# EAGLE design podlewacz_v4 (EAGLE 7.5.0)
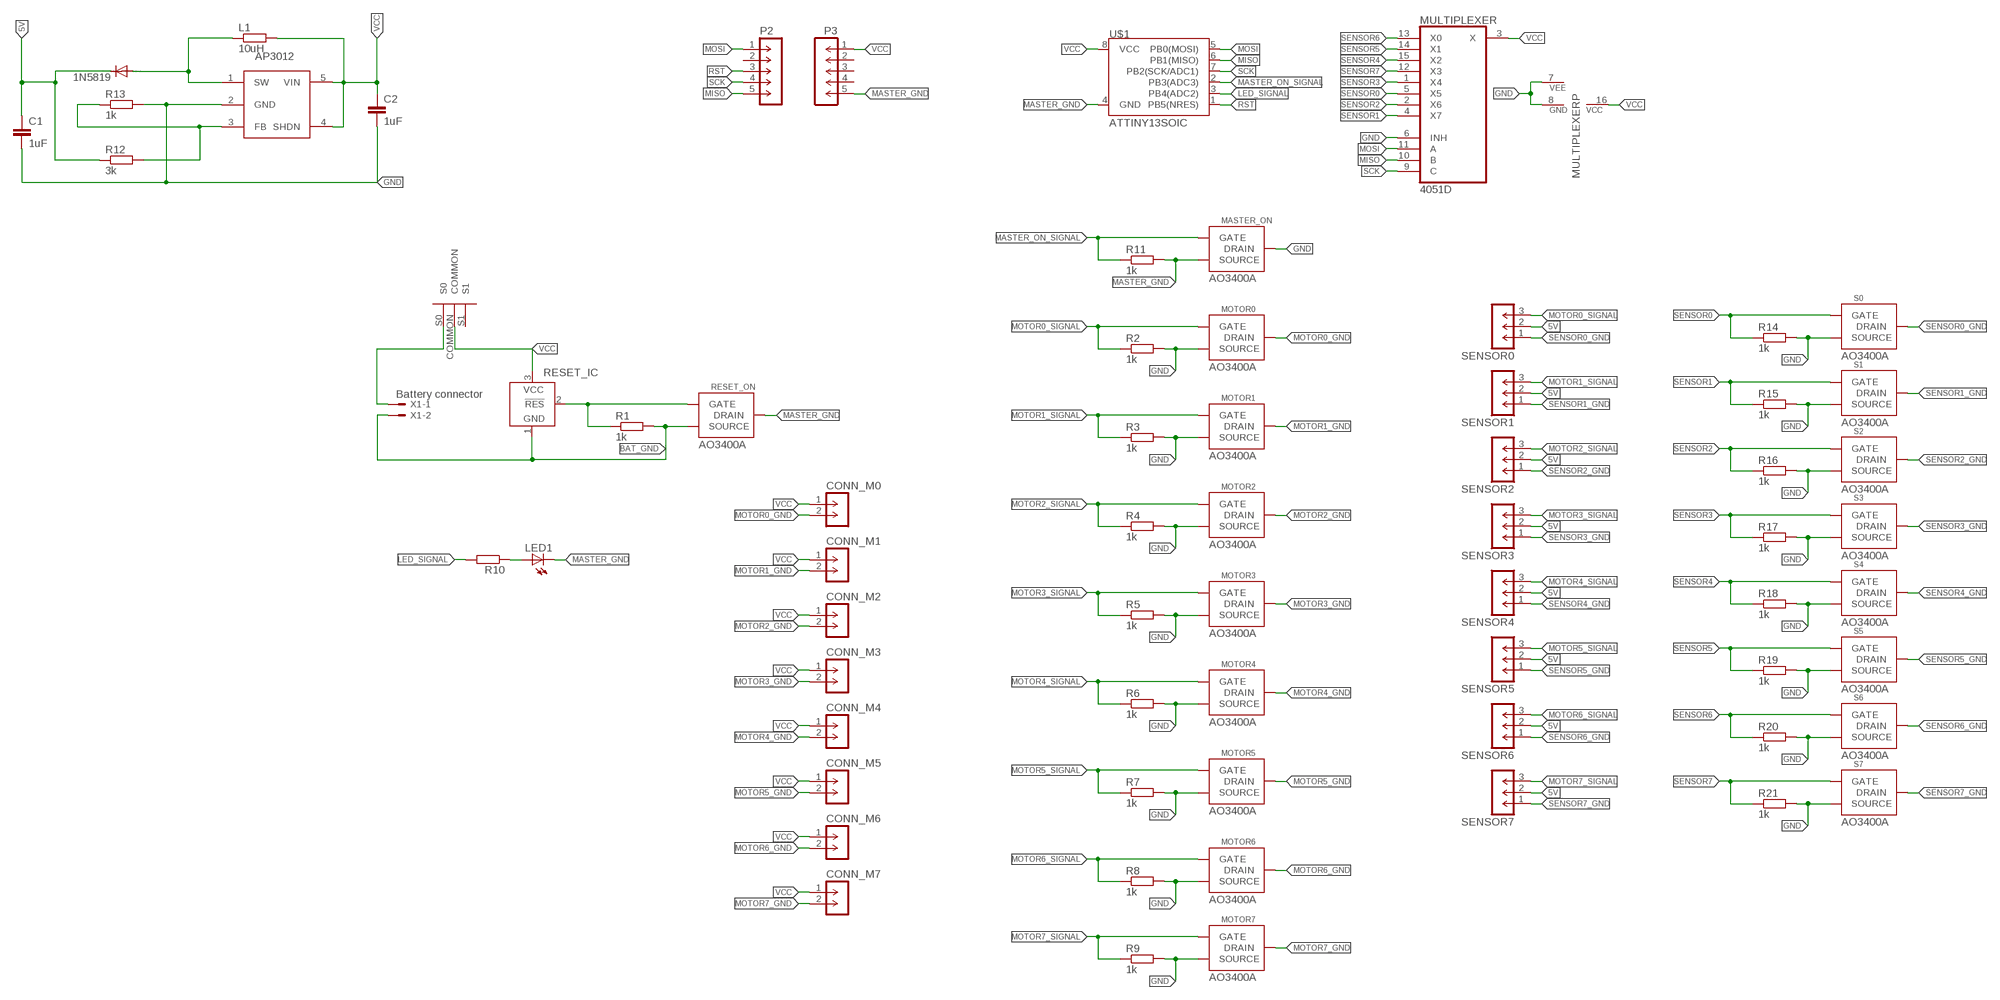
[diagram p0: schematic, sheet 1]

## Parts
1N5819  DIODE-DO214AC  [DO214AC]
AP3012  AP3012  [SOT-23-5]
C1  1uF  C-EUC1206  [C1206]
C2  1uF  C-EUC1206  [C1206]
CONN_M0  M-1X02-SIP-100-32Y  [SIP-100-02-32Y]
CONN_M1  M-1X02-SIP-100-32Y  [SIP-100-02-32Y]
CONN_M2  M-1X02-SIP-100-32Y  [SIP-100-02-32Y]
CONN_M3  M-1X02-SIP-100-32Y  [SIP-100-02-32Y]
CONN_M4  M-1X02-SIP-100-32Y  [SIP-100-02-32Y]
CONN_M5  M-1X02-SIP-100-32Y  [SIP-100-02-32Y]
CONN_M6  M-1X02-SIP-100-32Y  [SIP-100-02-32Y]
CONN_M7  M-1X02-SIP-100-32Y  [SIP-100-02-32Y]
L1  10uH  R-EU_R0805  [R0805]
LED1  LEDCHIP-LED0805  [CHIP-LED0805]
MASTER_ON  AO3400A  [SOT-23]
MOTOR0  AO3400A  [SOT-23]
MOTOR1  AO3400A  [SOT-23]
MOTOR2  AO3400A  [SOT-23]
MOTOR3  AO3400A  [SOT-23]
MOTOR4  AO3400A  [SOT-23]
MOTOR5  AO3400A  [SOT-23]
MOTOR6  AO3400A  [SOT-23]
MOTOR7  AO3400A  [SOT-23]
MULTIPLEXER  4051D  [SO16]
P2  M-1X05-SIP-100-32  [SIP-100-05-32]
P3  M-1X05-SIP-100-32  [SIP-100-05-32]
R1  1k  R-EU_M1206  [M1206]
R2  1k  R-EU_M1206  [M1206]
R3  1k  R-EU_M1206  [M1206]
R4  1k  R-EU_M1206  [M1206]
R5  1k  R-EU_M1206  [M1206]
R6  1k  R-EU_M1206  [M1206]
R7  1k  R-EU_M1206  [M1206]
R8  1k  R-EU_M1206  [M1206]
R9  1k  R-EU_M1206  [M1206]
R10  R-EU_M0805  [M0805]
R11  1k  R-EU_M1206  [M1206]
R12  3k  R-EU_M1206  [M1206]
R13  1k  R-EU_M1206  [M1206]
R14  1k  R-EU_M1206  [M1206]
R15  1k  R-EU_M1206  [M1206]
R16  1k  R-EU_M1206  [M1206]
R17  1k  R-EU_M1206  [M1206]
R18  1k  R-EU_M1206  [M1206]
R19  1k  R-EU_M1206  [M1206]
R20  1k  R-EU_M1206  [M1206]
R21  1k  R-EU_M1206  [M1206]
RESET_IC  TCM809  [SOT23B-3]
RESET_ON  AO3400A  [SOT-23]
S0  AO3400A  [SOT-23]
S1  AO3400A  [SOT-23]
S2  AO3400A  [SOT-23]
S3  AO3400A  [SOT-23]
S4  AO3400A  [SOT-23]
S5  AO3400A  [SOT-23]
S6  AO3400A  [SOT-23]
S7  AO3400A  [SOT-23]
SENSOR0  M-1X03-SIP-100-32Y  [SIP-100-03-32Y]
SENSOR1  M-1X03-SIP-100-32Y  [SIP-100-03-32Y]
SENSOR2  M-1X03-SIP-100-32Y  [SIP-100-03-32Y]
SENSOR3  M-1X03-SIP-100-32Y  [SIP-100-03-32Y]
SENSOR4  M-1X03-SIP-100-32Y  [SIP-100-03-32Y]
SENSOR5  M-1X03-SIP-100-32Y  [SIP-100-03-32Y]
SENSOR6  M-1X03-SIP-100-32Y  [SIP-100-03-32Y]
SENSOR7  M-1X03-SIP-100-32Y  [SIP-100-03-32Y]
U$1  ATTINY13SOIC  [SO08]
U$2  SPDT_SLIDE_SWITCH_2_PITCH  [SPDT_SLIDE_SWITCH_2_PITCH]
X1  Battery connector  22-23-2021  [22-23-2021]

## Nets
5V: 1N5819.C C1.1 R12.1 SENSOR0.2 SENSOR1.2 SENSOR2.2 SENSOR3.2 SENSOR4.2 SENSOR5.2 SENSOR6.2 SENSOR7.2
BAT_GND: R1.2 RESET_IC.1(GND) RESET_ON.2(SOURCE) X1.2
GND: AP3012.2(GND) C1.2 C2.2 MASTER_ON.3(DRAIN) MOTOR0.2(SOURCE) MOTOR1.2(SOURCE) MOTOR2.2(SOURCE) MOTOR3.2(SOURCE) MOTOR4.2(SOURCE) MOTOR5.2(SOURCE) MOTOR6.2(SOURCE) MOTOR7.2(SOURCE) MULTIPLEXER.6(INH) MULTIPLEXER.7(VEE) MULTIPLEXER.8(GND) R2.2 R3.2 R4.2 R5.2 R6.2 R7.2 R8.2 R9.2 R13.2 R14.2 R15.2 R16.2 R17.2 R18.2 R19.2 R20.2 R21.2 S0.2(SOURCE) S1.2(SOURCE) S2.2(SOURCE) S3.2(SOURCE) S4.2(SOURCE) S5.2(SOURCE) S6.2(SOURCE) S7.2(SOURCE)
LED_SIGNAL: R10.2 U$1.3(PB4(ADC2))
MASTER_GND: LED1.C MASTER_ON.2(SOURCE) P3.5 R11.2 RESET_ON.3(DRAIN) U$1.4(GND)
MASTER_ON: R1.1 RESET_IC.2(!RES) RESET_ON.1(GATE)
MASTER_ON_SIGNAL: MASTER_ON.1(GATE) R11.1 U$1.2(PB3(ADC3))
MISO: MULTIPLEXER.10(B) P2.5 U$1.6(PB1(MISO))
MOSI: MULTIPLEXER.11(A) P2.1 U$1.5(PB0(MOSI))
MOTOR0_GND: CONN_M0.2 MOTOR0.3(DRAIN)
MOTOR0_SIGNAL: MOTOR0.1(GATE) R2.1 SENSOR0.3
MOTOR1_GND: CONN_M1.2 MOTOR1.3(DRAIN)
MOTOR1_SIGNAL: MOTOR1.1(GATE) R3.1 SENSOR1.3
MOTOR2_GND: CONN_M2.2 MOTOR2.3(DRAIN)
MOTOR2_SIGNAL: MOTOR2.1(GATE) R4.1 SENSOR2.3
MOTOR3_GND: CONN_M3.2 MOTOR3.3(DRAIN)
MOTOR3_SIGNAL: MOTOR3.1(GATE) R5.1 SENSOR3.3
MOTOR4_GND: CONN_M4.2 MOTOR4.3(DRAIN)
MOTOR4_SIGNAL: MOTOR4.1(GATE) R6.1 SENSOR4.3
MOTOR5_GND: CONN_M5.2 MOTOR5.3(DRAIN)
MOTOR5_SIGNAL: MOTOR5.1(GATE) R7.1 SENSOR5.3
MOTOR6_GND: CONN_M6.2 MOTOR6.3(DRAIN)
MOTOR6_SIGNAL: MOTOR6.1(GATE) R8.1 SENSOR6.3
MOTOR7_GND: CONN_M7.2 MOTOR7.3(DRAIN)
MOTOR7_SIGNAL: MOTOR7.1(GATE) R9.1 SENSOR7.3
N$1: U$2.S0 X1.1
N$2: LED1.A R10.1
N$6: 1N5819.A AP3012.1(SW) L1.1
N$10: AP3012.3(FB) R12.2 R13.1
RST: P2.3 U$1.1(PB5(NRES))
SCK: MULTIPLEXER.9(C) P2.4 U$1.7(PB2(SCK/ADC1))
SENSOR0: MULTIPLEXER.5(X5) R14.1 S0.1(GATE)
SENSOR0_GND: S0.3(DRAIN) SENSOR0.1
SENSOR1: MULTIPLEXER.4(X7) R15.1 S1.1(GATE)
SENSOR1_GND: S1.3(DRAIN) SENSOR1.1
SENSOR2: MULTIPLEXER.2(X6) R16.1 S2.1(GATE)
SENSOR2_GND: S2.3(DRAIN) SENSOR2.1
SENSOR3: MULTIPLEXER.1(X4) R17.1 S3.1(GATE)
SENSOR3_GND: S3.3(DRAIN) SENSOR3.1
SENSOR4: MULTIPLEXER.15(X2) R18.1 S4.1(GATE)
SENSOR4_GND: S4.3(DRAIN) SENSOR4.1
SENSOR5: MULTIPLEXER.14(X1) R19.1 S5.1(GATE)
SENSOR5_GND: S5.3(DRAIN) SENSOR5.1
SENSOR6: MULTIPLEXER.13(X0) R20.1 S6.1(GATE)
SENSOR6_GND: S6.3(DRAIN) SENSOR6.1
SENSOR7: MULTIPLEXER.12(X3) R21.1 S7.1(GATE)
SENSOR7_GND: S7.3(DRAIN) SENSOR7.1
VCC: AP3012.4(SHDN) AP3012.5(VIN) C2.1 CONN_M0.1 CONN_M1.1 CONN_M2.1 CONN_M3.1 CONN_M4.1 CONN_M5.1 CONN_M6.1 CONN_M7.1 L1.2 MULTIPLEXER.3(X) MULTIPLEXER.16(VCC) P3.1 RESET_IC.3(VCC) U$1.8(VCC) U$2.COMMON
Unconnected: P2.2 P3.2 P3.3 P3.4 U$2.S1

## Library data of the parts
1N5819 = diode:DIODE-: DIODE
AP3012 = smd-footprints:AP3012
C1 C2 = resistor:C-EU: CAPACITOR, European symbol
CONN_M0 CONN_M1-CONN_M7 = con-headers-jp:M-1X02-: MALE HEADER
L1 R1-R21 = resistor:R-EU_: RESISTOR, European symbol
LED1 = led:LED: LED OSRAM: - CHIPLED LG R971, LG N971, LY N971, LG Q971, LY Q971, LO R971, LY R971 LH N974, LH R974 LS Q976, LO Q976, LY Q976 LO Q996 - Hyper CHIPLED LW Q18S LB Q993, LB Q99A, LB R99A - SideLED LS A670, LO A670, LY A670, LG A670, LP A670 LB A673, LV A673, LT A673, LW A673 LH A674 LY A675 LS A676, LA A676, LO A676, LY A676, LW A676 LS A679, LY A679, LG A679 - Hyper Micro SIDELED® LS Y876, LA Y876, LO Y876, LY Y876 LT Y87S - SmartLED LW L88C, LW L88S LB L89C, LB L89S, LG L890 LS L89K, LO L89K, LY L89K LS L896, LA L896, LO L896, LY L896 - TOPLED LS T670, LO T670, LY T670, LG T670, LP T670 LSG T670, LSP T670, LSY T670, LOP T670, LYG T670 LG T671, LOG T671, LSG T671 LB T673, LV T673, LT T673, LW T673 LH T674 LS T676, LA T676, LO T676, LY T676, LB T676, LH T676, LSB T676, LW T676 LB T67C, LV T67C, LT T67C, LS T67K, LO T67K, LY T67K, LW E67C LS E67B, LA E67B, LO E67B, LY E67B, LB E67C, LV E67C, LT E67C LW T67C LS T679, LY T679, LG T679 LS T770, LO T770, LY T770, LG T770, LP T770 LB T773, LV T773, LT T773, LW T773 LH T774 LS E675, LA E675, LY E675, LS T675 LS T776, LA T776, LO T776, LY T776, LB T776 LHGB T686 LT T68C, LB T68C - Hyper Mini TOPLED® LB M676 - Mini TOPLED Santana® LG M470 LS M47K, LO M47K, LY M47K Source: http://www.osram.convergy.de LUXEON: - LUMILED® LXK2-PW12-R00, LXK2-PW12-S00, LXK2-PW14-U00, LXK2-PW14-V00 LXK2-PM12-R00, LXK2-PM12-S00, LXK2-PM14-U00 LXK2-PE12-Q00, LXK2-PE12-R00, LXK2-PE12-S00, LXK2-PE14-T00, LXK2-PE14-U00 LXK2-PB12-K00, LXK2-PB12-L00, LXK2-PB12-M00, LXK2-PB14-N00, LXK2-PB14-P00, LXK2-PB14-Q00 LXK2-PR12-L00, LXK2-PR12-M00, LXK2-PR14-Q00, LXK2-PR14-R00 LXK2-PD12-Q00, LXK2-PD12-R00, LXK2-PD12-S00 LXK2-PH12-R00, LXK2-PH12-S00 LXK2-PL12-P00, LXK2-PL12-Q00, LXK2-PL12-R00 Source: www.luxeon.com KINGBRIGHT: KA-3528ASYC Source: www.kingbright.com
MASTER_ON MOTOR0 MOTOR1-MOTOR7 RESET_ON S0 S1-S7 = smd-footprints:AO3400A
MULTIPLEXER = 40xx:4051: 8-channel ANALOG MULTIPLEXER
P2 P3 = con-headers-jp:M-1X05-: MALE HEADER
RESET_IC = telcom:TCM809: POWER SUPPLY MONITOR replacement for Maxim MAX809 and MAX810; MF: MICROCHIP; MPN: TCM809MENB713; OC_FARNELL: 9762744; OC_NEWARK: 96K3998
SENSOR0 SENSOR1-SENSOR7 = con-headers-jp:M-1X03-: MALE HEADER
U$1 = SparkFun-DigitalIC:ATTINY13: Atmel 8-pin 1kB flash uC
U$2 = sh4dov lib:SPDT_SLIDE_SWITCH_2_PITCH
X1 = con-molex:22-23-2021: .100" (2.54mm) Center Header - 2 Pin; MF: MOLEX; MPN: 22-23-2021; OC_FARNELL: 1462926; OC_NEWARK: 25C3832

## Board
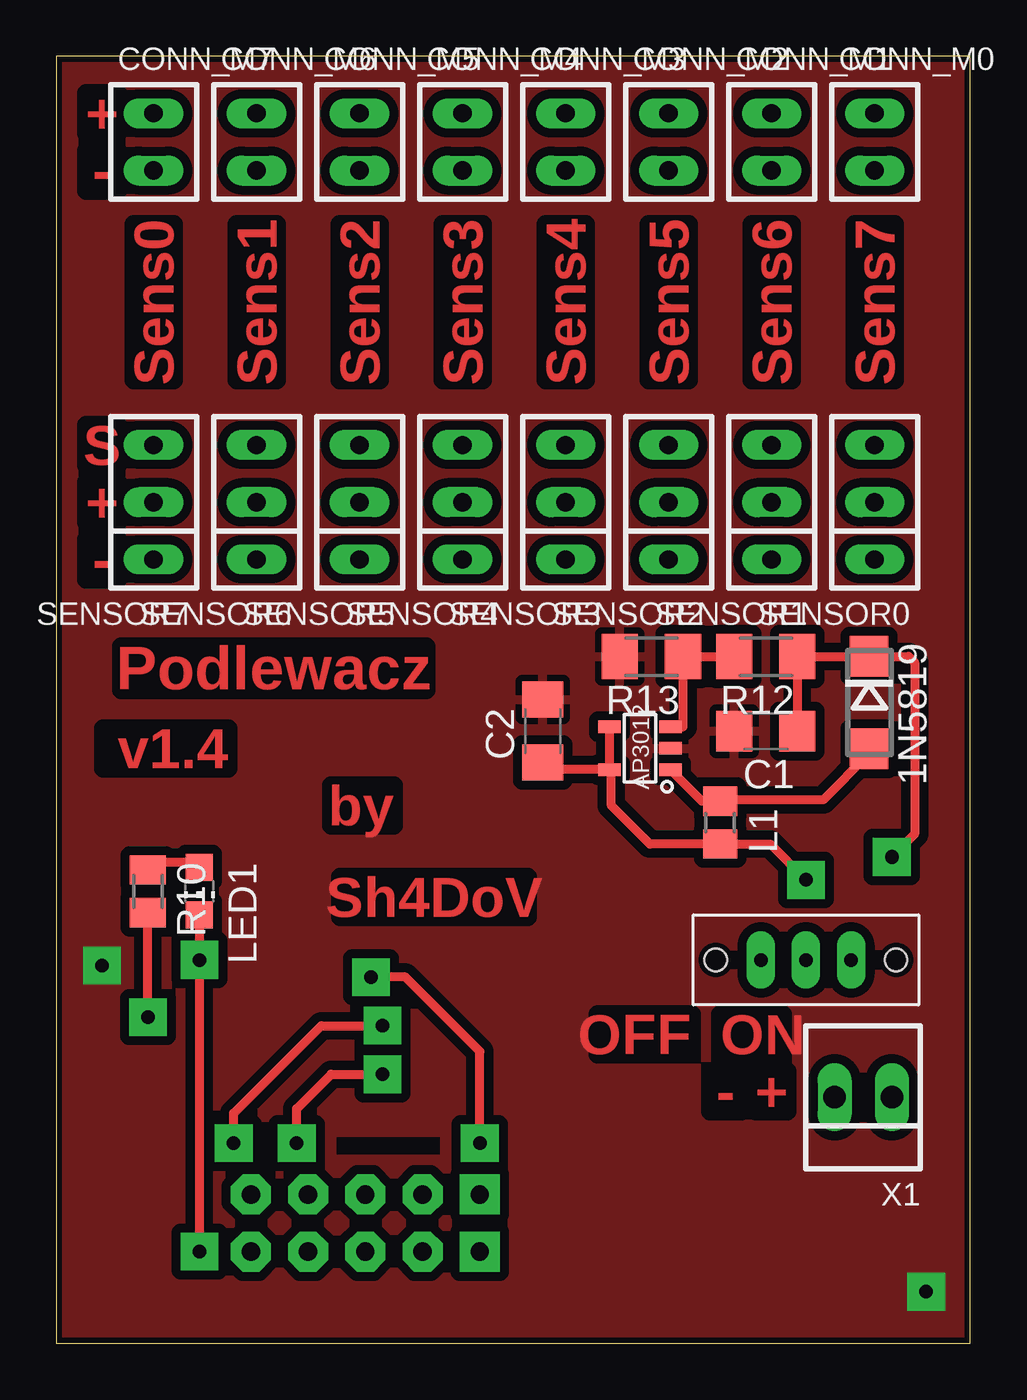
[diagram p1: board, top side]
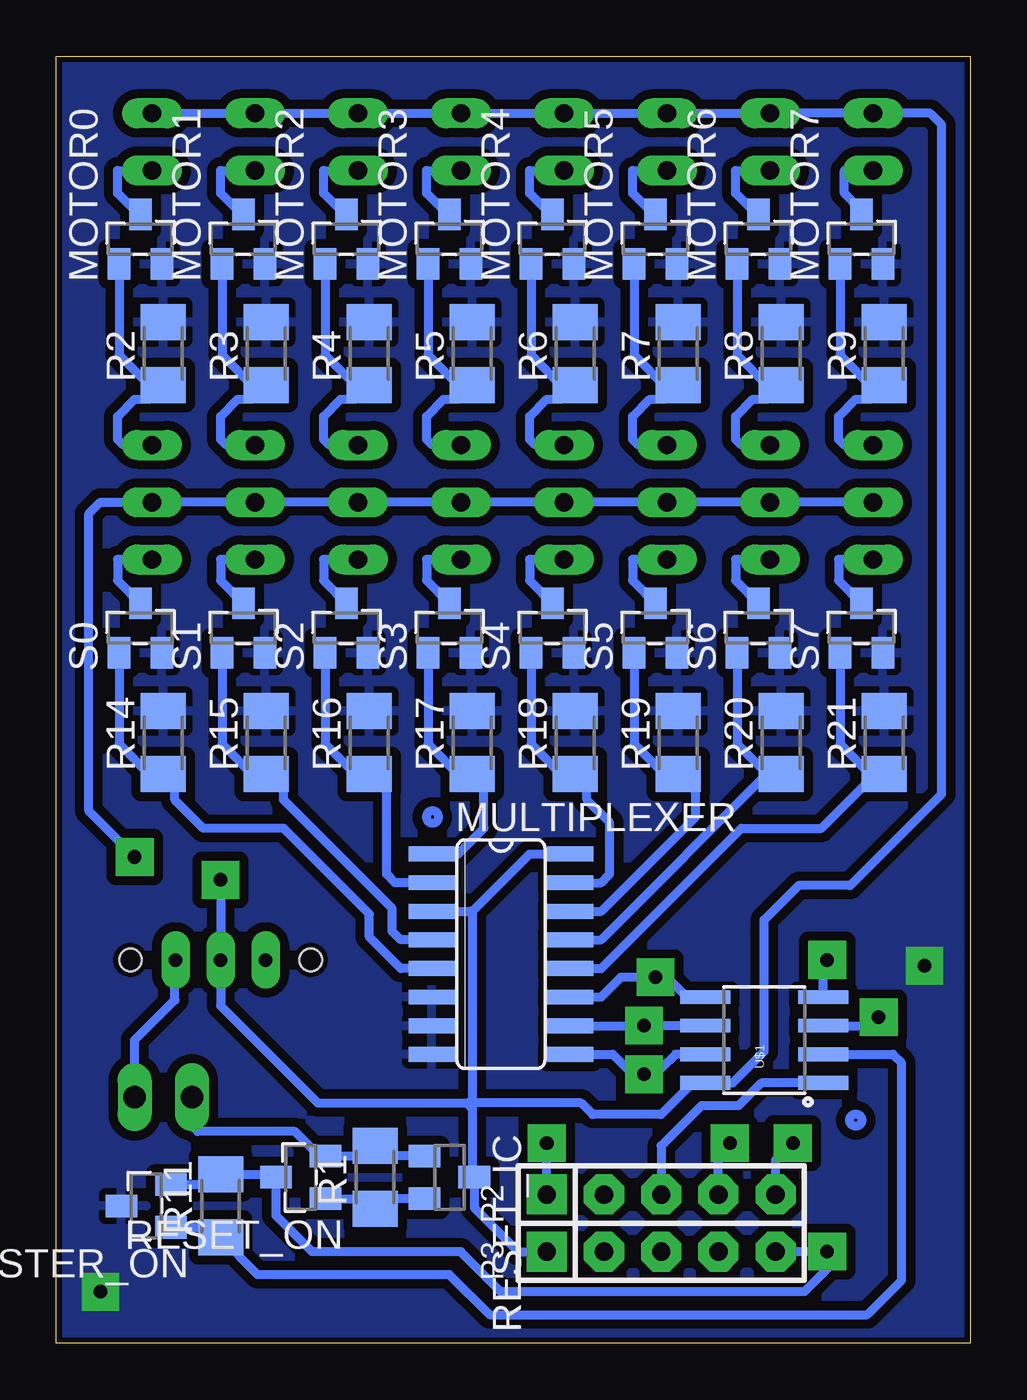
[diagram p2: board, bottom side, seen from below]

Size 40.56 x 57.14 mm. Coordinates in mm from the lower left corner, seen from the top.
Outline: 0,0 40.56,0 40.56,57.14 0,57.14 0,0
Copper layers (1*16): Top 0.035mm / dielectric 1.5mm / Bottom 0.035mm
Design rules "default 16mils": minimum track width 10mil, minimum drill 24mil, track to track 16mil, track to pad 16mil, pad to pad 16mil, via to via 16mil, smd to smd 10mil, copper to edge 10mil, drill to drill 10mil, minimum pad ring 10mil, minimum via ring 8mil, stop-mask expansion 4mil, vias tented up to drill 0mil, thermal gap 12mil
tRestrict: area 12.4,8.4 to 17,9.1

### Footprints (pad centres in the part's own frame; a part is rotated, then mirrored left to right if it is on the bottom)
DO214AC = smd 1.8 x 1.7: A 2.05,0; C -2.05,0
SOT-23-5 = smd 1 x 0.55: 1 -1.35,0.95; 2 -1.35,0; 3 -1.35,-0.95; 4 1.35,-0.95; 5 1.35,0.95
C1206 = smd 1.6 x 1.8: 1 -1.4,0; 2 1.4,0
SIP-100-02-32Y = drill 0.813 long: 1 -1.27,0; 2 1.27,0
R0805 = smd 1.3 x 1.5: 1 -0.95,0; 2 0.95,0
CHIP-LED0805 = smd 1.2 x 1.2: A 0,-1.05; C 0,1.05
SOT-23 = smd 1 x 1.4: 1 -0.95,-1.1; 2 0.95,-1.1; 3 0,1.1
SO16 = smd 0.66 x 2.032: 1 -4.445,-3.073; 2 -3.175,-3.073; 3 -1.905,-3.073; 4 -0.635,-3.073; 5 0.635,-3.073; 6 1.905,-3.073; 7 3.175,-3.073; 8 4.445,-3.073; 9 4.445,3.073; 10 3.175,3.073; 11 1.905,3.073; 12 0.635,3.073; 13 -0.635,3.073; 14 -1.905,3.073; 15 -3.175,3.073; 16 -4.445,3.073
SIP-100-05-32 = drill 0.813 pad 1.778 square: 1 -5.08,0 | drill 0.813 pad 1.778 octagon: 2 -2.54,0; 3 0,0; 4 2.54,0; 5 5.08,0
M1206 = smd 1.6 x 2: 1 -1.4,0; 2 1.4,0
M0805 = smd 1.3 x 1.6: 1 -0.95,0; 2 0.95,0
SOT23B-3 = smd 1 x 1.4: 1 -0.95,-1.1; 2 0.95,-1.1; 3 0,1.1
SIP-100-03-32Y = drill 0.813 long: 1 -2.54,0; 2 0,0; 3 2.54,0
SO08 = smd 0.61 x 2.21: 1 -1.905,-2.616; 2 -0.635,-2.616; 3 0.635,-2.616; 4 1.905,-2.616; 5 1.905,2.616; 6 0.635,2.616; 7 -0.635,2.616; 8 -1.905,2.616
SPDT_SLIDE_SWITCH_2_PITCH = drill 0.6 pad 1.27 long: COMMON 0,0; S0 -2,0; S1 2,0 | hole 1: -4,0; 4,0
22-23-2021 = drill 1 long: 1 -1.27,0; 2 1.27,0

### Placement (x,y rotation side)
1N5819  36.07,28.45 270 top
AP3012  25.91,26.42 180 top
C1  31.5,27.18 180 top
C2  21.59,27.18 90 top
CONN_M0  36.32,53.34 270 top
CONN_M1  31.75,53.34 270 top
CONN_M2  27.18,53.34 270 top
CONN_M3  22.61,53.34 270 top
CONN_M4  18.03,53.34 270 top
CONN_M5  13.46,53.34 270 top
CONN_M6  8.89,53.34 270 top
CONN_M7  4.32,53.34 270 top
L1  29.46,23.11 270 top
LED1  6.35,20.07 180 top
MASTER_ON  36.58,6.1 90 bottom
MOTOR0  36.83,49.02 0 bottom
MOTOR1  32.26,49.02 0 bottom
MOTOR2  27.69,49.02 0 bottom
MOTOR3  23.11,49.02 0 bottom
MOTOR4  18.54,49.02 0 bottom
MOTOR5  13.97,49.02 0 bottom
MOTOR6  9.4,49.02 0 bottom
MOTOR7  4.83,49.02 0 bottom
MULTIPLEXER  20.83,17.27 270 bottom
P2  13.72,6.6 0 bottom
P3  13.72,4.06 0 bottom
R1  26.42,7.37 90 bottom
R2  35.81,43.94 90 bottom
R3  31.24,43.94 90 bottom
R4  26.67,43.94 90 bottom
R5  22.1,43.94 90 bottom
R6  17.53,43.94 90 bottom
R7  12.95,43.94 90 bottom
R8  8.38,43.94 90 bottom
R9  3.81,43.94 90 bottom
R10  4.06,20.07 270 top
R11  33.27,6.1 90 bottom
R12  31.5,30.48 180 top
R13  26.42,30.48 180 top
R14  35.81,26.67 90 bottom
R15  31.24,26.67 90 bottom
R16  26.67,26.67 90 bottom
R17  22.1,26.67 90 bottom
R18  17.53,26.67 90 bottom
R19  12.95,26.67 90 bottom
R20  8.38,26.67 90 bottom
R21  3.81,26.67 90 bottom
RESET_IC  23.11,7.37 270 bottom
RESET_ON  29.72,7.37 90 bottom
S0  36.83,31.75 0 bottom
S1  32.26,31.75 0 bottom
S2  27.69,31.75 0 bottom
S3  23.11,31.75 0 bottom
S4  18.54,31.75 0 bottom
S5  13.97,31.75 0 bottom
S6  9.4,31.75 0 bottom
S7  4.83,31.75 0 bottom
SENSOR0  36.32,37.34 90 top
SENSOR1  31.75,37.34 90 top
SENSOR2  27.18,37.34 90 top
SENSOR3  22.61,37.34 90 top
SENSOR4  18.03,37.34 90 top
SENSOR5  13.46,37.34 90 top
SENSOR6  8.89,37.34 90 top
SENSOR7  4.32,37.34 90 top
U$1  9.14,13.46 90 bottom
U$2  33.27,17.02 180 top
X1  35.81,10.92 180 top

### Tracks (layer width: path | path; a pad name or v marks a point on that pad's centre or on a via)
5V  (via drill 0.6 pad 1.68)
  Top 0.406: C1.1 R12.1 36.05,30.48 1N5819.C 37.83,30.5 38.1,30.23 38.1,22.61 v37.08,21.59
  Bottom 0.406: SENSOR7.2 SENSOR6.2 SENSOR5.2 SENSOR4.2 SENSOR3.2 SENSOR2.2 SENSOR1.2 SENSOR0.2 38.61,37.34 39.12,36.83 39.12,23.62 v37.08,21.59
BAT_GND
  Bottom 0.406: 26.42,8.32 R1.2 | RESET_IC.1 25.97,8.32 R1.2 | R1.2 26.87,8.32 RESET_ON.2 28.89,8.32 29.97,9.4 34.29,9.4 34.54,9.65 X1.2
GND  (via drill 0.6 pad 1.68)
  other vias: 2.03,16.76 38.61,2.29
  pour Bottom: 0,57.15 40.64,57.15 40.64,0 0,0
  pour Top: 0,57.15 40.64,57.15 40.64,0 0,0
LED_SIGNAL  (via drill 0.6 pad 1.68)
  Top 0.406: v4.06,14.48 R10.2
  Bottom 0.406: U$1.3 4.45,14.1 v4.06,14.48
MASTER_GND  (via drill 0.6 pad 1.68)
  Top 0.406: v6.35,4.06 v6.35,17.02 LED1.C
  Bottom 0.406: MASTER_ON.2 33.72,7.05 R11.2 30.95,7.5 RESET_ON.3 30.82,5.67 29.21,4.06 22.61,4.06 20.83,2.29 7.37,2.29 6.35,3.3 v6.35,4.06 P3.5 | U$1.4 6.53,16.84 v6.35,17.02
MASTER_ON
  Bottom 0.406: 26.42,6.42 R1.1 | RESET_IC.2 25.97,6.42 R1.1 | RESET_ON.1 26.87,6.42 R1.1
MASTER_ON_SIGNAL
  Bottom 0.406: MASTER_ON.1 33.72,5.15 R11.1 31.63,3.05 23.11,3.05 21.34,1.27 4.57,1.27 3.05,2.79 3.05,12.45 3.43,12.83 U$1.2
MISO  (via drill 0.6 pad 1.68)
  Top 0.406: v7.87,8.89 7.87,10.21 U$1.6 v14.48,14.1
  Bottom 0.406: MULTIPLEXER.10 v14.48,14.1 U$1.6 | P2.5 8.64,8.13 v7.87,8.89
MOSI  (via drill 0.6 pad 1.68)
  Top 0.406: v18.8,8.89 18.8,12.95 15.49,16.26 v13.97,16.26
  Bottom 0.406: P2.1 v18.8,8.89 | U$1.5 12.57,15.37 13.46,16.26 v13.97,16.26 15.49,16.26 16.38,15.37 MULTIPLEXER.11
MOTOR0_GND
  Bottom 0.406: MOTOR0.3 36.91,50.12 37.85,51.05 37.85,52.07 CONN_M0.2
MOTOR0_SIGNAL
  Bottom 0.406: MOTOR0.1 37.78,43.88 36.58,42.67 35.94,42.67 R2.1 36.45,41.91 37.08,41.91 37.85,41.15 37.85,40.13 37.59,39.88 SENSOR0.3
MOTOR1_GND
  Bottom 0.406: MOTOR1.3 32.34,50.12 33.27,51.05 33.27,52.07 CONN_M1.2
MOTOR1_SIGNAL
  Bottom 0.406: MOTOR1.1 33.21,43.88 31.75,42.42 31.37,42.42 R3.1 31.87,41.91 32.51,41.91 33.27,41.15 33.27,40.13 33.02,39.88 SENSOR1.3
MOTOR2_GND
  Bottom 0.406: MOTOR2.3 27.77,50.12 28.7,51.05 28.7,52.07 CONN_M2.2
MOTOR2_SIGNAL
  Bottom 0.406: MOTOR2.1 28.64,43.88 27.43,42.67 26.8,42.67 R4.1 27.3,41.91 27.94,41.91 28.7,41.15 28.7,40.13 28.45,39.88 SENSOR2.3
MOTOR3_GND
  Bottom 0.406: MOTOR3.3 23.2,50.12 24.13,51.05 24.13,52.07 CONN_M3.2
MOTOR3_SIGNAL
  Bottom 0.406: MOTOR3.1 24.06,43.88 22.86,42.67 22.23,42.67 R5.1 22.73,41.91 23.37,41.91 24.13,41.15 24.13,40.13 23.88,39.88 SENSOR3.3
MOTOR4_GND
  Bottom 0.406: MOTOR4.3 18.63,50.12 19.56,51.05 19.56,52.07 CONN_M4.2
MOTOR4_SIGNAL
  Bottom 0.406: MOTOR4.1 19.49,43.88 18.03,42.42 17.65,42.42 R6.1 18.16,41.91 18.8,41.91 19.56,41.15 19.56,40.13 19.3,39.88 SENSOR4.3
MOTOR5_GND
  Bottom 0.406: MOTOR5.3 14.05,50.12 14.99,51.05 14.99,52.07 CONN_M5.2
MOTOR5_SIGNAL
  Bottom 0.406: MOTOR5.1 14.92,43.88 13.46,42.42 13.08,42.42 R7.1 13.59,41.91 14.22,41.91 14.99,41.15 14.99,40.13 14.73,39.88 SENSOR5.3
MOTOR6_GND
  Bottom 0.406: MOTOR6.3 9.48,50.12 10.41,51.05 10.41,52.07 CONN_M6.2
MOTOR6_SIGNAL
  Bottom 0.406: MOTOR6.1 10.35,43.88 8.89,42.42 8.51,42.42 R8.1 9.01,41.91 9.65,41.91 10.41,41.15 10.41,40.13 10.16,39.88 SENSOR6.3
MOTOR7_GND
  Bottom 0.406: MOTOR7.3 4.83,50.29 5.59,51.05 5.59,52.07 CONN_M7.2
MOTOR7_SIGNAL
  Bottom 0.406: MOTOR7.1 5.78,43.88 4.32,42.42 3.93,42.42 R9.1 4.44,41.91 5.08,41.91 5.84,41.15 5.84,40.13 5.59,39.88 SENSOR7.3
N$1
  Bottom 0.406: X1.1 37.08,13.46 35.31,15.24 35.31,16.48 U$2.S0
N$2
  Top 0.406: 4.42,21.12 R10.1 4.38,21.34 6.1,21.34 6.32,21.12 LED1.A
N$3
  pour Bottom: 0,0 40.64,0 40.64,57.15 0,57.15
N$5
  pour Top: 0,0 40.64,0 40.64,57.15 0,57.15
N$6
  Top 0.406: 1N5819.A 36.07,26.16 34.04,24.13 29.53,24.13 L1.1 28.66,24.06 AP3012.1
N$10
  Top 0.406: R12.2 R13.1 27.82,27.37 AP3012.3
RST
  Bottom 0.406: U$1.1 9.27,11.56 10.29,10.54 11.94,10.54 13.72,8.76 P2.3
SCK  (via drill 0.6 pad 1.68)
  Top 0.406: v10.67,8.89 10.67,10.41 12.19,11.94 v14.48,11.94
  Bottom 0.406: MULTIPLEXER.9 15.87,12.83 15.24,12.19 v14.48,11.94 13.72,12.19 13.08,12.83 U$1.7 | P2.4 11.18,8.38 v10.67,8.89
SENSOR0
  Bottom 0.406: MULTIPLEXER.5 25.27,16.64 26.67,18.03 26.67,19.05 30.48,22.86 34.04,22.86 35.31,24.13 35.31,24.76 R14.1 35.94,25.15 36.32,25.15 37.78,26.6 S0.1
SENSOR0_GND
  Bottom 0.406: SENSOR0.1 37.85,34.8 37.85,33.87 S0.3
SENSOR1
  Bottom 0.406: MULTIPLEXER.4 25.27,17.91 25.65,18.29 25.65,19.3 30.48,24.13 30.48,24.51 R15.1 31.37,25.15 31.75,25.15 33.21,26.6 S1.1
SENSOR1_GND
  Bottom 0.406: SENSOR1.1 33.27,34.8 33.27,33.87 S1.3
SENSOR2
  Bottom 0.406: MULTIPLEXER.2 25.53,20.45 25.91,20.83 25.91,24.51 R16.1 26.8,25.4 27.43,25.4 28.64,26.6 S2.1
SENSOR2_GND
  Bottom 0.406: SENSOR2.1 28.7,34.8 28.7,33.87 S2.3
SENSOR3
  Bottom 0.406: MULTIPLEXER.1 22.73,21.72 21.59,22.86 21.59,24.76 R17.1 22.22,25.15 22.61,25.15 24.06,26.6 S3.1
SENSOR3_GND
  Bottom 0.406: SENSOR3.1 24.13,34.8 24.13,33.87 S3.3
SENSOR4
  Bottom 0.406: MULTIPLEXER.15 16.38,20.45 16,20.83 16,23.11 17.02,24.13 17.02,24.76 R18.1 17.65,25.15 18.03,25.15 19.49,26.6 S4.1
SENSOR4_GND
  Bottom 0.406: SENSOR4.1 19.56,34.8 19.56,33.87 S4.3
SENSOR5
  Bottom 0.406: MULTIPLEXER.14 16.38,19.18 12.19,23.37 12.19,24.51 R19.1 13.08,25.4 13.72,25.4 14.92,26.6 S5.1
SENSOR5_GND
  Bottom 0.406: SENSOR5.1 14.99,34.8 14.99,33.87 S5.3
SENSOR6
  Bottom 0.406: MULTIPLEXER.13 16.38,17.91 8.89,25.4 | S6.1 10.35,26.6 9.14,25.4 8.89,25.4 | 8.89,25.4 8.51,25.4 R20.1
SENSOR6_GND
  Bottom 0.406: SENSOR6.1 10.41,34.8 10.41,33.87 S6.3
SENSOR7
  Bottom 0.406: MULTIPLEXER.12 16.38,16.64 10.16,22.86 6.6,22.86 4.32,25.15 | S7.1 5.78,26.6 4.32,25.15 | 4.32,25.15 3.93,25.15 R21.1
SENSOR7_GND
  Bottom 0.406: SENSOR7.1 5.84,34.8 5.84,33.87 S7.3
VCC  (via drill 0.6 pad 1.68)
  Top 0.406: AP3012.5 AP3012.4 | AP3012.5 21.9,25.47 C2.1 | AP3012.5 24.64,25.39 24.64,23.88 26.35,22.16 L1.2 31.68,22.16 v33.27,20.57
  Bottom 0.406: CONN_M0.1 CONN_M1.1 CONN_M2.1 CONN_M3.1 CONN_M4.1 CONN_M5.1 CONN_M6.1 CONN_M7.1 1.78,54.61 1.27,54.1 1.27,24.38 5.33,20.32 7.62,20.32 9.14,18.8 9.14,12.95 10.54,11.56 U$1.8 12.32,11.56 13.72,10.16 16.76,10.16 17.27,10.67 22.35,10.67 | MULTIPLEXER.16 19.56,21.72 22.1,19.18 MULTIPLEXER.3 22.23,19.18 22.1,19.05 22.1,10.41 | 22.1,10.41 22.1,7.45 RESET_IC.3 22.01,6.01 20.07,4.06 P3.1 | 22.35,10.67 22.61,10.67 28.96,10.67 33.27,14.99 U$2.COMMON v33.27,20.57 | 22.35,10.67 22.1,10.41
(copper drawn outside any net)
  shapes: Bottom circle x2

### Text on the board
Top: + | - | Sens0 | Sens1 | Sens2 | Sens3 | Sens4 | Sens5 | Sens6 | Sens7 | S | + | - | Podlewacz | v1.4 | by | Sh4DoV | OFF | ON | - | +